# Altium project Controlled_car_stm32_tx.PrjPcb
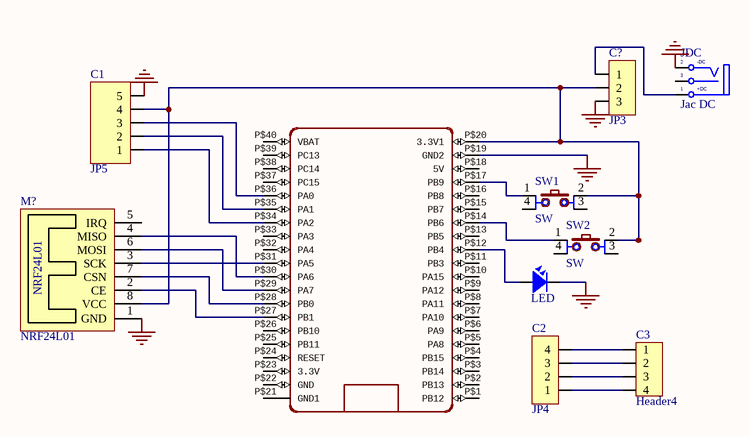
[diagram p0: Sheet2.SchDoc]
1 sheet, 10 parts. Net scope: global (net labels, ports and power ports of the same name join across sheets).
Board file: PCB2.PcbDoc

## Sheet Sheet2.SchDoc
size A

### Parts
?  BLUE_PILL  [BLUE_PILL]  (value not drawn)
C1  JP5  [JP5-D1T]
C2  JP4  [JP4-C1T]
C3  Header4  [Header4]
C?  JP3  [JP3-C1T]
JDC  Jac DC  [DC0]
LED  LED  [LED-5-Green]  (value not drawn)
M?  NRF24L01  [NRF24L01]
SW1  SW  [SW2-DIP]
SW2  SW  [SW2-DIP]

### Nets
GND: ?.P$19(GND2) C1.5 C?.3 JDC.2(TN) LED.2 M?.1(GND)
Net?_P$12: ?.P$12(PB4) LED.1
Net?_P$14: ?.P$14(PB6) SW2.1
Net?_P$17: ?.P$17(PB9) SW1.1
Net?_P$20: ?.P$20(3.3V1) C1.4 C?.2 M?.8(VCC) SW1.2 SW2.2
Net?_P$27: ?.P$27(PB1) M?.2(CE)
Net?_P$28: ?.P$28(PB0) M?.7(CSN)
Net?_P$29: ?.P$29(PA7) M?.6(MOSI)
Net?_P$30: ?.P$30(PA6) M?.4(MISO)
Net?_P$31: ?.P$31(PA5) M?.3(SCK)
Net?_P$34: ?.P$34(PA2) C1.1
Net?_P$35: ?.P$35(PA1) C1.2
Net?_P$36: ?.P$36(PA0) C1.3
NetC2_1: C2.1 C3.4
NetC2_2: C2.2 C3.3
NetC2_3: C2.3 C3.2
NetC2_4: C2.4 C3.1
NetC?_1: C?.1 JDC.1(T)

Not connected (* = marked no-connect by the designer): ? P$1(PB12) P$2(PB13) P$3(PB14) P$4(PB15) P$5(PA8) P$6(PA9) P$7(PA10) P$8(PA11) P$9(PA12) P$10(PA15) P$11(PB3) P$13(PB5) P$15(PB7) P$16(PB8) P$18(5V) P$21(GND1) P$22(GND) P$23(3.3V) P$24(RESET) P$25(PB11) P$26(PB10) P$32(PA4) P$33(PA3) P$37(PC15) P$38(PC14) P$39(PC13) P$40(VBAT); JDC 3(S); M? 5(IRQ); SW1 3 4; SW2 3 4

### Notes on the sheet
- (in symbol DCIN) -DC; +DC

### Library data of the parts
? = BLUE_PILL: GateName_1: G$1; SymbolName_1: BLUE_PILL; LibraryName: BluePill; DeviceSetName: BLUE_PILL; Package: BLUE_PILL
C1 = JP5: WR-PHD 2.54 mm Angled Socket Header; Manufacturer: W¨¹rth Elektronik eiSos GmbH; partNo: 613005143121; ComponentLink1 Description: Manufacturer; ComponentLink2 Description: Datasheet; NoPins: 05; Created Date: 29 March 2013; ComponentLink1URL: http://www.we-online.com; ComponentLink2URL: http://katalog.we-online.de/em/datasheet/6130xx143121.pdf; Created by: Karrer Zheng
C2 = JP4: WR-PHD 2.54 mm Angled Socket Header; Manufacturer: W¨¹rth Elektronik eiSos GmbH; partNo: 613004143121; ComponentLink1 Description: Manufacturer; ComponentLink2 Description: Datasheet; NoPins: 04; Created Date: 29 March 2013; ComponentLink1URL: http://www.we-online.com; ComponentLink2URL: http://katalog.we-online.de/em/datasheet/6130xx143121.pdf; Created by: Karrer Zheng
C3 = Header4: Header IDC, 4 x 1 Pin Vertical 2.54mm Pitch (Non-Boxed, Male); Manufacturer: W¨¹rth Elektronik eiSos GmbH; partNo: 613002143121; ComponentLink1 Description: Manufacturer; ComponentLink2 Description: Datasheet; NoPins: 02; Created Date: 29 March 2013; ComponentLink1URL: http://www.we-online.com; ComponentLink2URL: http://katalog.we-online.de/em/datasheet/6130xx143121.pdf; Created by: Karrer Zheng
C? = JP3: WR-PHD 2.54 mm Angled Socket Header; Manufacturer: W¨¹rth Elektronik eiSos GmbH; partNo: 613003143121; ComponentLink1 Description: Manufacturer; ComponentLink2 Description: Datasheet; NoPins: 03; Created Date: 29 March 2013; ComponentLink1URL: http://www.we-online.com; ComponentLink2URL: http://katalog.we-online.de/em/datasheet/6130xx143121.pdf; Created by: Karrer Zheng
JDC = DCIN: Jac DC input; Value: Jac DC
LED = LED: LED Single colour Green and Red; Value: LED 3 ly Single Colour
SW1 SW2 = SW4: Switch button 4 pin; Value: Button chip 4 pin